# Altium schematic sheet MCU.SchDoc
size A; SheetNumber: 2; SheetTotal: 3
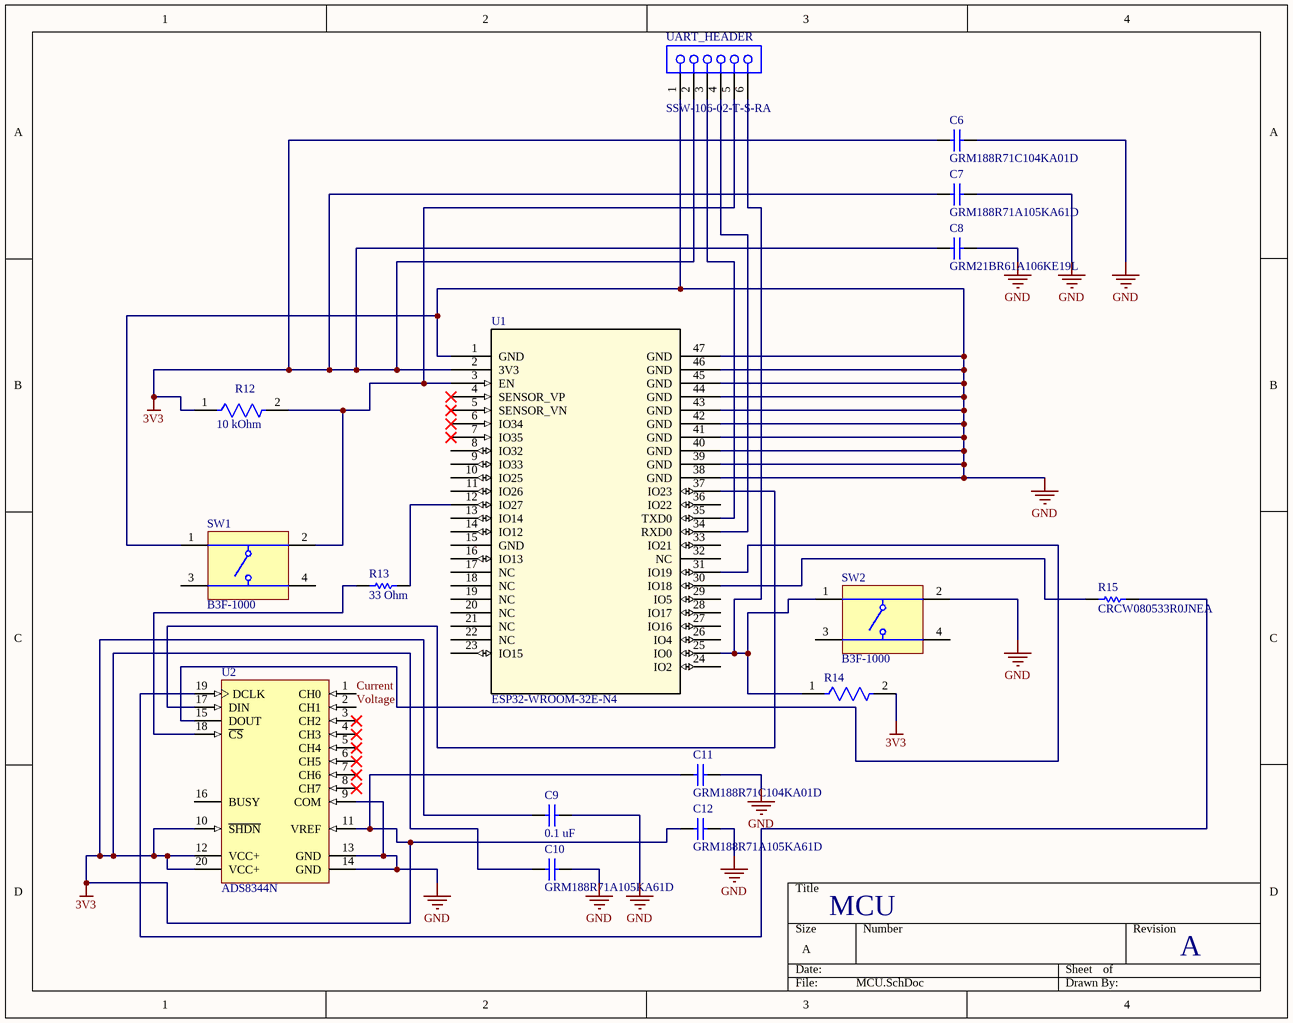
[diagram p0: MCU.SchDoc]

## Parts
C6  GRM188R71C104KA01D  [MURA-0603_H_0.9_N]
C7  GRM188R71A105KA61D  [CAPC1608X90X35ML10T15]
C8  GRM21BR61A106KE19L  [MURA-0805_H_1.35_L]
C9  0.1 uF  [MURA-0603_H_0.9_N]
C10  GRM188R71A105KA61D  [CAPC1608X90X35ML10T15]
C11  GRM188R71C104KA01D  [MURA-0603_H_0.9_N]
C12  GRM188R71A105KA61D  [CAPC1608X90X35ML10T15]
R12  10 kOhm  [FP-RC0603-0_55-IPC_B]
R13  33 Ohm  [RESC2013X50X30ML20T20]
R14  RC0603FR-0710KL  [FP-RC0603-0_55-IPC_B]  (value not drawn)
R15  CRCW080533R0JNEA  [RESC2013X50X30ML20T20]
SW1  B3F-1000  [OMRON-B3F-1000-4_V]
SW2  B3F-1000  [OMRON-B3F-1000-4_V]
U1  ESP32-WROOM-32E-N4  [ESP32­WROOM­32E_EXP]
U2  ADS8344N  [TI-DB20_L]
UART_HEADER  SSW-106-02-T-S-RA  [SMTC-SSW-106-02-X-S-RA]

## Nets
3V3: C6.1 C7.1 C8.1 C9.1 C10.1 C11.1 C12.1 R12.1 R14.2 U1.2(3V3) U2.10(~{SHDN}) U2.11(VREF) U2.12(VCC+) U2.20(VCC+) UART_HEADER.2
GND: C6.2 C7.2 C8.2 C9.2 C10.2 C11.2 C12.2 SW1.1 SW2.2 U1.1(GND) U1.38(GND) U1.39(GND) U1.40(GND) U1.41(GND) U1.42(GND) U1.43(GND) U1.44(GND) U1.45(GND) U1.46(GND) U1.47(GND) U2.9(COM) U2.13(GND) U2.14(GND) UART_HEADER.1
Current: U2.1(CH0)
Voltage: U2.2(CH1)
NetR12_2: R12.2 SW1.2 U1.3(EN) UART_HEADER.5
NetR13_1: R13.1 U2.18(~{CS})
NetR13_2: R13.2 U1.12(IO27)
NetR14_1: R14.1 SW2.1 U1.25(IO0) UART_HEADER.6
NetR15_1: R15.1 U1.30(IO18)
NetR15_2: R15.2 U2.19(DCLK)
NetU1_31: U1.31(IO19) U2.15(DOUT)
NetU1_34: U1.34(RXD0) UART_HEADER.4
NetU1_35: U1.35(TXD0) UART_HEADER.3
NetU1_37: U1.37(IO23) U2.17(DIN)

Not connected (* = marked no-connect by the designer): SW1 3 4; SW2 3 4; U1 4(SENSOR_VP)* 5(SENSOR_VN)* 6(IO34)* 7(IO35)* 8(IO32) 9(IO33) 10(IO25) 11(IO26) 13(IO14) 14(IO12) 15(GND) 16(IO13) 17(NC) 18(NC) 19(NC) 20(NC) 21(NC) 22(NC) 23(IO15) 24(IO2) 26(IO4) 27(IO16) 28(IO17) 29(IO5) 32(NC) 33(IO21) 36(IO22); U2 3(CH2)* 4(CH3)* 5(CH4)* 6(CH5)* 7(CH6)* 8(CH7)* 16(BUSY)

## Notes on the sheet
- MCU
- A

## Library data of the parts
C6 C9 C11 = CMP-2000-05253-1: CAP, Ceramic, 0.1 uF, 10%, 16 V, 0603, RoHS, Tape and Reel; Manufacturer: Murata; Capacitance - pF: 100000pF; Case Length: 1.6mm; Voltage Rating DC: 16V; Brand: MurataElectronics; Temperature Coefficient / Code: +/-15%; Case Width: 0.8mm; Type: GeneralPurposeMLCC; Capacitance: 0.1uF; Dielectric: X7R; Capacitance - nF: 100nF; Product Category: MultilayerCeramicCapacitorsMLCC-SMD/SMT; Datasheet URL: https://datasheet.ciiva.com/29202/451467-da-01-en-vs-kondensator-0603-29202287.pdf; Termination Style: SMD/SMT; Operating Temperature Range: -55Cto+125C; Case Code - in: 0603; Datasheet Version: Dec-10; Dimensions: 0.8mmWx1.6mmLx0.8mmH; RoHS: Details; Case Code - mm: 1608; Product: GeneralTypeMLCCs; Voltage Rating: 16V; Package / Case: 0603(1608metric); Factory Pack Quantity: 4000; Packaging: Reel; Maximum Operating Temperature: +125C; Manufacturer URL: http://www.murata.com/; Case Height: 0.8mm; Minimum Operating Temperature: -55C; Series: GRM; Tolerance: 10%
C7 C10 C12 = CMP-2006-02831-1: Manufacturer: Murata; Part Number: GRM188R71A105KA61D
C8 = CMP-2000-05254-1: CAP, Ceramic, 10 uF, 10%, 10 V, 0805, RoHS, Tape and Reel; Manufacturer: Murata; Voltage - Rated: 10V; Product Training Modules: High-CapMultilayerCeramicCapacitors; Catalog Drawings: GRMSeries_0805_1.25; Temperature Coefficient: X5R; Online Catalog: GRMSeries; Featured Product: GA3SafetyRecognizedCapsandHi-CapMLCC; Capacitance: 10µF; Other Names: 490-1709-6; Applications: GeneralPurpose; Category: Capacitors; Datasheet Version: Aug-14; Datasheet URL: https://datasheet.ciiva.com/3777/210grm21br61a106ke1923-3777175.pdf; Ratings: -; Height - Seated (Max): -; Lead Spacing: -; Operating Temperature: -55degC~85degC; Features: -; Package Description: 2-Pin Surface Mount Device (0805), Body 2.1 x 1.35 mm; Standard Package: 1; Mounting Type: SurfaceMount,MLCC; Package Reference: 805; Tolerance: ±10%; Manufacturer URL: http://www.murata.com/; Size / Dimension: 0.079"Lx0.049"W(2.00mmx1.25mm); Packaging: Digi-Reel; Thickness (Max): 0.053"(1.35mm); Package / Case: 0805(2012Metric); Family: CeramicCapacitors; Series: GRM; Lead Style: -
R12 R14 = CMP-2100-03664-2: RES 10K OHM 1% 1/10W 0603; Voltage Rating: 75V; Voltage Rating (DC): 50V; Resistance: 10kR; Power Rating: 100mW; Temperature Coefficient: 100ppm/°C; Depth: 0.8mm; Termination: SMD/SMT; Resistor Type: Thick Film; Series: RC; Construction: Rectangular; Features: Moisture Resistant; Packaging: Tape and Reel; Min Operating Temperature: -55°C; Number of Terminations: 2; Lead Pitch: 0.3mm; RoHS Compliant: Yes; Case/Package: 0603; Resistance Tolerance: 1%; Military Standard: Not; Weight: 7.1E-05oz; Number of Pins: 2; Tolerance: 1%; Length: 1.6mm; Case Code (Imperial): 0603; Lead Free: Lead Free; Width: 0.8mm; Max Power Dissipation: 100mW; Height: 0.45mm; Max Operating Temperature: 155°C; Case Code (Metric): 1608; Size Code: 0603
R13 = CMP-1013-00038-2: Manufacturer: Vishay Dale; Part Number: CRCW080533R0JNEA
R15 = CMP-1013-00038-2: Manufacturer: Vishay Dale; Part Number: CRCW080533R0JNEA
SW1 SW2 = CMP-1677-00002-1: Tactile Switch, SPST-NO, 0.05 A, 5 to 24 V, -25 to 70 degC, 4-Pin THD, RoHS, Bulk; Shielding: Shielded; Gender: Female; Capacitance: -45 f; Voltage Rating: 150 V; Current Rating: 1.5 A; Radiation Hardening: No; Contact Plating: Gold; Height: 14.99 mm; Min Operating Temperature: -40 degC; Packaging: Tray; ComponentLink2Description: Datasheet; ComponentLink1URL: http://www.omron.com/; Lead Pitch: 1.27 mm; RoHSCompliant: true; Pins: 8; PackageReference: B3F-1000; Width: 25.4 mm; Contact Material: Brass; ComponentLink2URL: http://www.omron.com/ecb/products/pdf/en-b3f.pdf; PackageDescription: 4-Pin Through Hole Device, Body 6 x 6 mm; DatasheetVersion: Jan-15; ComponentLink1Description: Manufacturer URL; Package Quantity: 1080; Mount: Through Hole; Length: 18.34 mm; Max Operating Temperature: 70 degC
U1 = ESP32-WROOM-32E-N4: Description; Manufacturer_Name: Espressif Systems; Copyright: Copyright (C) 2025 Ultra Librarian. All rights reserved.; Manufacturer_Part_Number: ESP32-WROOM-32E-N4; RefDes: RefDes; Type: Type
U2 = CMP-0003-01266-1: 16-Bit, 8-Channel Serial Output Sampling ADC, -40 to 85 degC, 20-pin SOP (DB20), Green (RoHS & no Sb/Br); Manufacturer: Texas Instruments; # Input Channels: 8; SINAD(dB): 86; Sample Rate (max)(SPS): 100k; Analog Voltage AV/DD(Min)(V): 2.7; Architecture: SAR; Analog Voltage AV/DD(Max)(V): 5.25; SFDR(dB): 92; Interface: Serial SPI; INL(Max)(+/-LSB): 6; SubFamily: Precision ADC (<=10MSPS); Resolution(Bits): 16; PackageReference: DB20; Digital Supply(Max)(V): 5.25; Digital Supply(Min)(V): 2.7; ComponentLink1Description: Manufacturer URL; ComponentLink1URL: http://www.ti.com/; PartNumber: ADS8344N; ComponentLink3URL: http://www.ti.com/lit/ml/msso002e/msso002e.pdf; ComponentLink2URL: http://www.ti.com/general/docs/lit/getliterature.tsp?genericPartNumber=ADS8344&fileType=pdf; Code_JEDEC: MO-150; PackageDescription: 20-Pin Plastic Small Outline, Body 5.3 x 7.2 mm, Pitch 0.65 mm; DatasheetVersion: SBAS139E; ComponentLink2Description: Datasheet; ComponentLink3Description: Package Specification; PackageVersion: 4040065/E, 12/2001; Eco-Plan: Green (RoHS & no Sb/Br); Mounting Technology: Surface Mount
UART_HEADER = CMP-1023-00364-1: SQ Post Socket, Through-hole, Right Angle, -55 to 105 degC, 2.54mm Pitch, 6-Pin, Female, RoHS; Manufacturer: Samtec; DatasheetVersion: F-214; PackageReference: SSW-106-02-X-S-RA; ComponentLink1URL: http://www.samtec.com; Temperature Range: -55 to 105 degC; Orientation: Right Angle; ComponentLink2Description: Datasheet; PartNumber: SSW-106-02-T-S-RA; PackageVersion: CA, 6/1987; Pitch: 2.54 mm; Mounting Technology: Through-hole; PackageDescription: Assembly, Socket Strip .016 X .031 Tail; ComponentLink2URL: http://www.samtec.com/documents/webfiles/pdf/SSW_TH.PDF; RoHS: True; ComponentLink3URL: http://www.samtec.com/documents/webfiles/cpdf/SSW-1XX-XX-XXX-X-XX-XXX-XX-MKT.pdf; ComponentLink1Description: Manufacturer URL; ComponentLink3Description: Package Specification